# Altium schematic sheet CONNDIN96.SchDoc
size A3
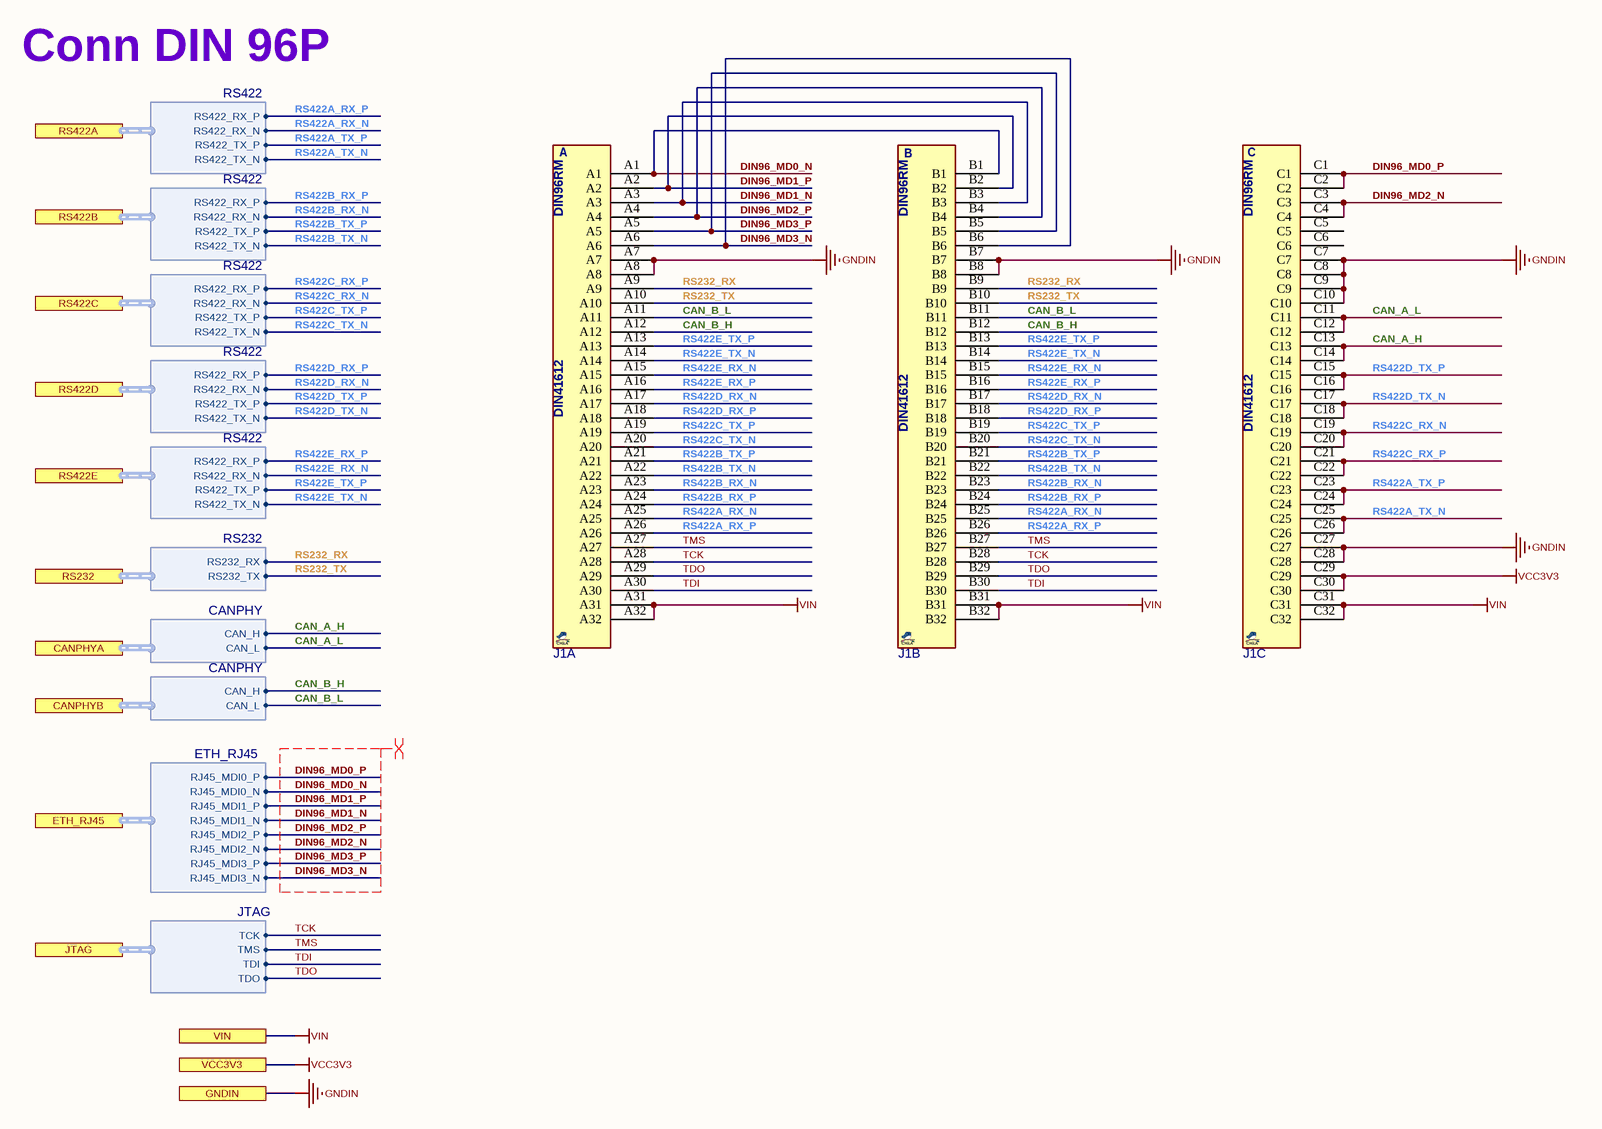
[diagram p0: CONNDIN96.SchDoc]

## Parts
J1  DIN96SM  [DIN_96SM]  (value not drawn)  (parts A,B,C of 3)

## Ports
CANPHYA (harness CANPHY), CANPHYB (harness CANPHY), ETH_RJ45 (harness ETH_RJ45), GNDIN, JTAG (harness JTAG), RS232 (harness RS232), RS422A (harness RS422), RS422B (harness RS422), RS422C (harness RS422), RS422D (harness RS422), RS422E (harness RS422), VCC3V3, VIN

## Harnesses
ETH_RJ45: RJ45_MDI0_P, RJ45_MDI0_N, RJ45_MDI1_P, RJ45_MDI1_N, RJ45_MDI2_P, RJ45_MDI2_N, RJ45_MDI3_P, RJ45_MDI3_N
RS422: RS422_RX_P, RS422_RX_N, RS422_TX_P, RS422_TX_N
RS232: RS232_RX, RS232_TX
CANPHY: CAN_H, CAN_L
JTAG: TCK, TMS, TDI, TDO

## Nets
GNDIN: J1.A7 J1.A8 J1.B7 J1.B8 J1.C7 J1.C8 J1.C9 J1.C10 J1.C27 J1.C28 ; port GNDIN
VCC3V3: J1.C29 J1.C30 ; port VCC3V3
VIN: J1.A31 J1.A32 J1.B31 J1.B32 J1.C31 J1.C32 ; port VIN
CAN_A_H: J1.C13 J1.C14 ; port CANPHYA.CAN_H
CAN_A_L: J1.C11 J1.C12 ; port CANPHYA.CAN_L
CAN_B_H: J1.A12 J1.B12 ; port CANPHYB.CAN_H
CAN_B_L: J1.A11 J1.B11 ; port CANPHYB.CAN_L
DIN96_MD0_N: J1.A1 J1.B1 ; port ETH_RJ45.RJ45_MDI0_N
DIN96_MD0_P: J1.C1 J1.C2 ; port ETH_RJ45.RJ45_MDI0_P
DIN96_MD1_N: J1.A3 J1.B3 ; port ETH_RJ45.RJ45_MDI1_N
DIN96_MD1_P: J1.A2 J1.B2 ; port ETH_RJ45.RJ45_MDI1_P
DIN96_MD2_N: J1.C3 J1.C4 ; port ETH_RJ45.RJ45_MDI2_N
DIN96_MD2_P: J1.A4 J1.B4 ; port ETH_RJ45.RJ45_MDI2_P
DIN96_MD3_N: J1.A6 J1.B6 ; port ETH_RJ45.RJ45_MDI3_N
DIN96_MD3_P: J1.A5 J1.B5 ; port ETH_RJ45.RJ45_MDI3_P
RS232_RX: J1.A9 J1.B9 ; port RS232.RS232_RX
RS232_TX: J1.A10 J1.B10 ; port RS232.RS232_TX
RS422A_RX_N: J1.A25 J1.B25 ; port RS422A.RS422_RX_N
RS422A_RX_P: J1.A26 J1.B26 ; port RS422A.RS422_RX_P
RS422A_TX_N: J1.C25 J1.C26 ; port RS422A.RS422_TX_N
RS422A_TX_P: J1.C23 J1.C24 ; port RS422A.RS422_TX_P
RS422B_RX_N: J1.A23 J1.B23 ; port RS422B.RS422_RX_N
RS422B_RX_P: J1.A24 J1.B24 ; port RS422B.RS422_RX_P
RS422B_TX_N: J1.A22 J1.B22 ; port RS422B.RS422_TX_N
RS422B_TX_P: J1.A21 J1.B21 ; port RS422B.RS422_TX_P
RS422C_RX_N: J1.C19 J1.C20 ; port RS422C.RS422_RX_N
RS422C_RX_P: J1.C21 J1.C22 ; port RS422C.RS422_RX_P
RS422C_TX_N: J1.A20 J1.B20 ; port RS422C.RS422_TX_N
RS422C_TX_P: J1.A19 J1.B19 ; port RS422C.RS422_TX_P
RS422D_RX_N: J1.A17 J1.B17 ; port RS422D.RS422_RX_N
RS422D_RX_P: J1.A18 J1.B18 ; port RS422D.RS422_RX_P
RS422D_TX_N: J1.C17 J1.C18 ; port RS422D.RS422_TX_N
RS422D_TX_P: J1.C15 J1.C16 ; port RS422D.RS422_TX_P
RS422E_RX_N: J1.A15 J1.B15 ; port RS422E.RS422_RX_N
RS422E_RX_P: J1.A16 J1.B16 ; port RS422E.RS422_RX_P
RS422E_TX_N: J1.A14 J1.B14 ; port RS422E.RS422_TX_N
RS422E_TX_P: J1.A13 J1.B13 ; port RS422E.RS422_TX_P
TCK: J1.A28 J1.B28 ; port JTAG.TCK
TDI: J1.A30 J1.B30 ; port JTAG.TDI
TDO: J1.A29 J1.B29 ; port JTAG.TDO
TMS: J1.A27 J1.B27 ; port JTAG.TMS

Not connected (* = marked no-connect by the designer): J1 C5 C6

## Layout directives
differential pair: DIN96_MD0_N, DIN96_MD0_P, DIN96_MD1_N, DIN96_MD1_P, DIN96_MD2_N, DIN96_MD2_P, DIN96_MD3_N, DIN96_MD3_P

## Notes on the sheet
- Conn DIN 96P
- Title
- Size:
- Date:
- A3
- Number:
- Time:
- Revision:
- Sheet
- of
- File:
- (in symbol DIN41612_96SM, part A) A; DIN96RM; DIN41612
- (in symbol DIN41612_96SM, part B) B; DIN96RM; DIN41612
- (in symbol DIN41612_96SM, part C) C; DIN96RM; DIN41612

## Library data of the parts
J1 = DIN41612_96SM: DIN 41612, 2.54mm,pin,DIN 41612,solder,PCB,96w,; MANF: TE; DESC: compatible female 535089-5; MANF_P#: 650470-5; VALUE: DIN96SM